# EAGLE schematic kulgurpowerMCU2 (EAGLE 6.3)

## Sheet 1 of 6
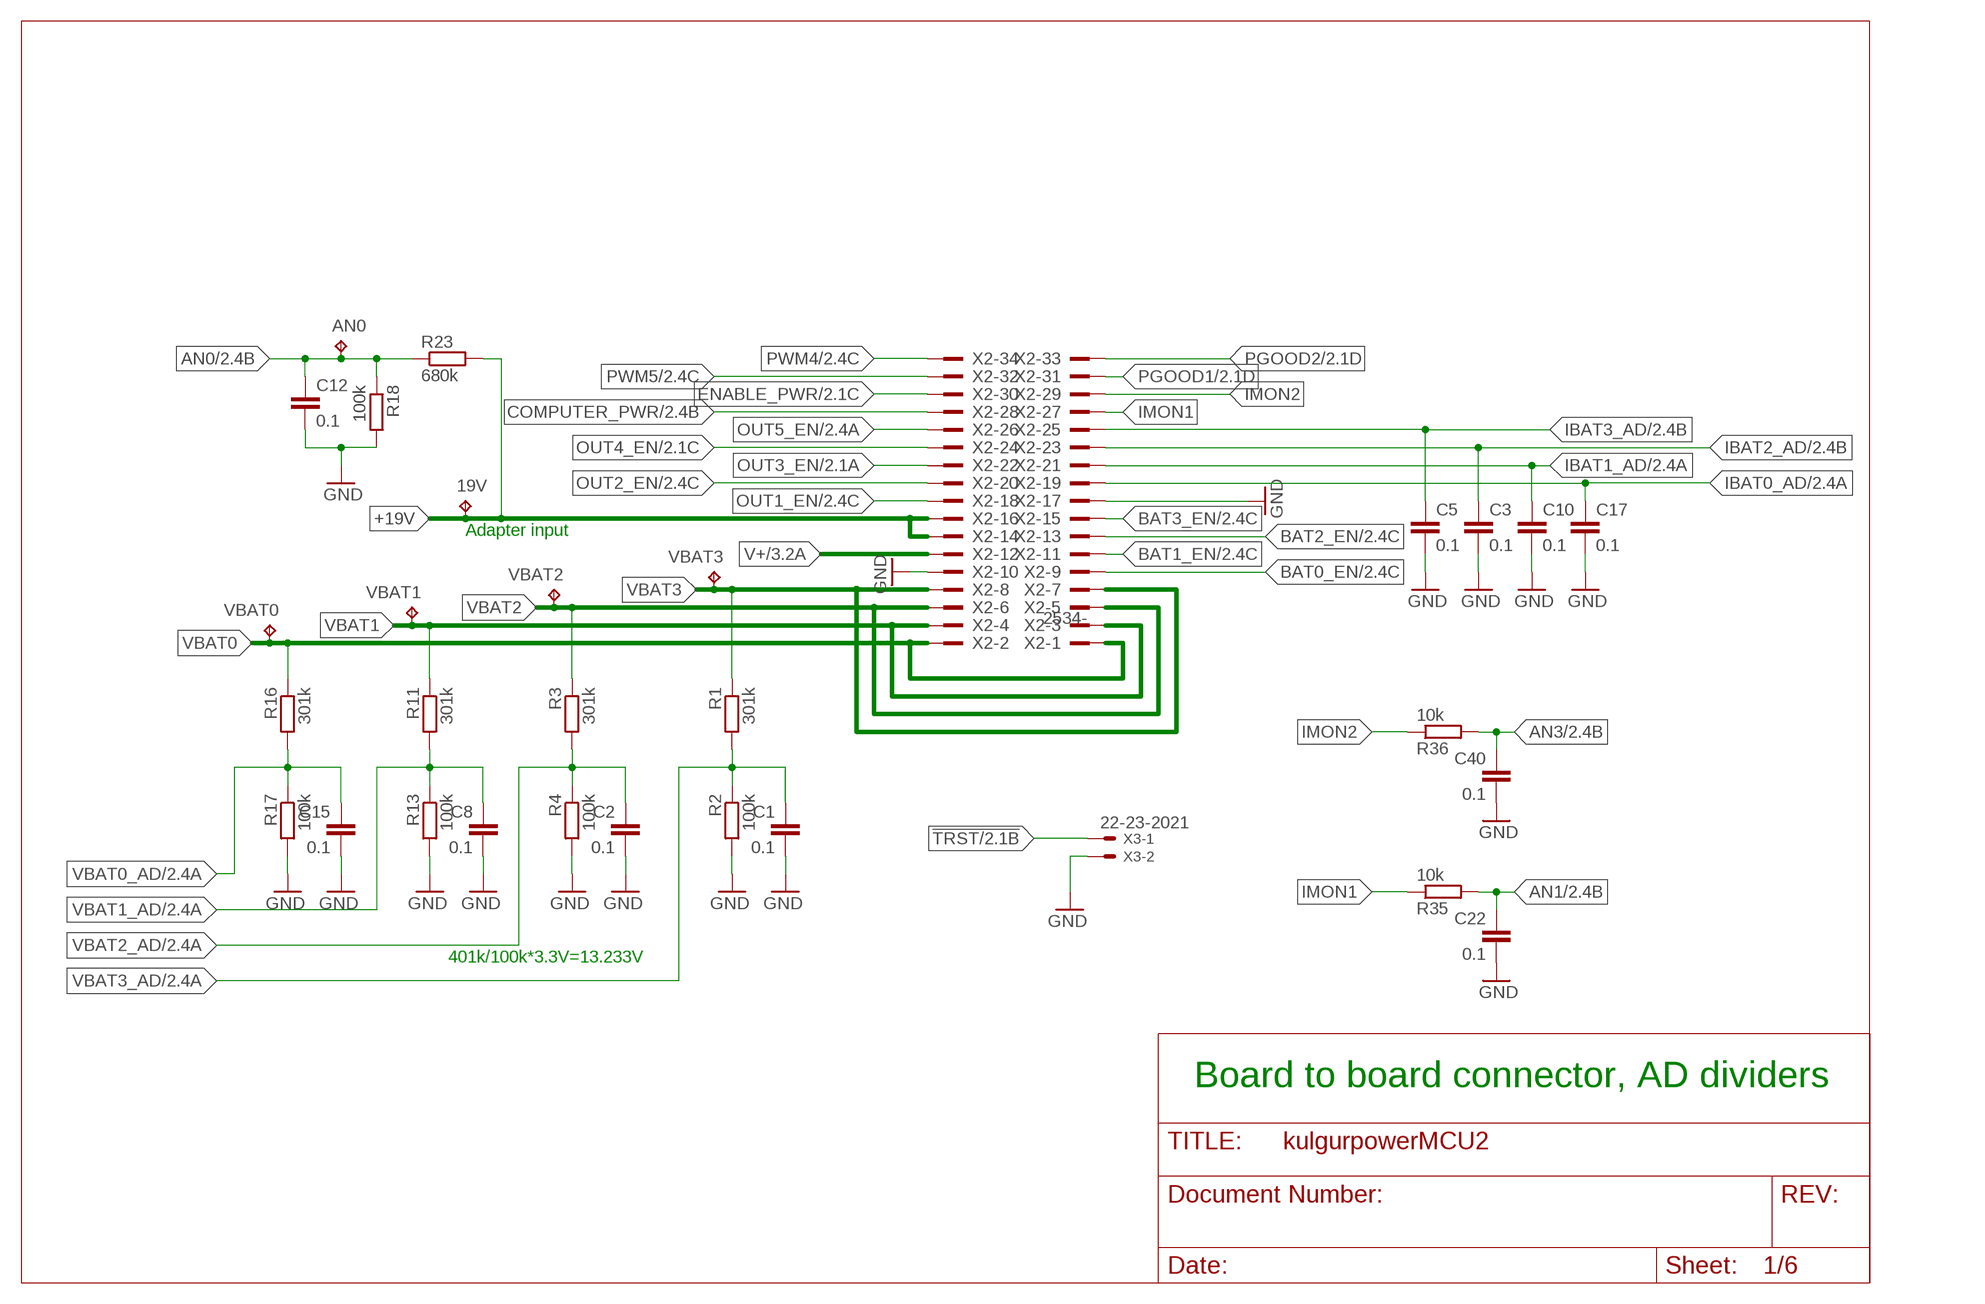
[diagram p0: schematic, sheet 1]

### Parts
19V  TPB1,27  [B1,27]
AN0  TPB1,27  [B1,27]
C1  0.1  C-EUC0603  [C0603]
C2  0.1  C-EUC0603  [C0603]
C3  0.1  C-EUC0603  [C0603]
C5  0.1  C-EUC0603  [C0603]
C8  0.1  C-EUC0603  [C0603]
C10  0.1  C-EUC0603  [C0603]
C12  0.1  CAP0603-CAP  [0603-CAP]
C15  0.1  C-EUC0603  [C0603]
C17  0.1  C-EUC0603  [C0603]
C22  0.1  C-EUC0603  [C0603]
C40  0.1  C-EUC0603  [C0603]
R1  301k  R-EU_R0603  [R0603]
R2  100k  R-EU_R0603  [R0603]
R3  301k  R-EU_R0603  [R0603]
R4  100k  R-EU_R0603  [R0603]
R11  301k  R-EU_R0603  [R0603]
R13  100k  R-EU_R0603  [R0603]
R16  301k  R-EU_R0603  [R0603]
R17  100k  R-EU_R0603  [R0603]
R18  100k  R-EU_R0603  [R0603]
R23  680k  R-EU_R0603  [R0603]
R35  10k  R-EU_R0603  [R0603]
R36  10k  R-EU_R0603  [R0603]
VBAT0  TPB1,27  [B1,27]
VBAT1  TPB1,27  [B1,27]
VBAT2  TPB1,27  [B1,27]
VBAT3  TPB1,27  [B1,27]
X2  2534-  [PAK100/2500-34]
X3  22-23-2021  [22-23-2021]

### Nets
!TRST: X3.1 ; also sheet 2,4
+19V [morepower]: 19V.TP R23.2 X2.14 X2.16 ; also sheet 6
AN0: AN0.TP C12.1 R18.1 R23.1 ; also sheet 2
AN1: C22.1 R35.2 ; also sheet 2
AN3: C40.1 R36.2 ; also sheet 2
BAT0_EN: X2.9 ; also sheet 2
BAT1_EN: X2.11 ; also sheet 2
BAT2_EN: X2.13 ; also sheet 2
BAT3_EN: X2.15 ; also sheet 2
COMPUTER_PWR: X2.28 ; also sheet 2
ENABLE_PWR: X2.30 ; also sheet 2
GND: C1.2 C2.2 C3.2 C5.2 C8.2 C10.2 C12.2 C15.2 C17.2 C22.2 C40.2 R2.2 R4.2 R13.2 R17.2 R18.2 X2.10 X2.17 X3.2 ; also sheet 2,3,4,5,6
IBAT0_AD: C17.1 X2.19 ; also sheet 2
IBAT1_AD: C10.1 X2.21 ; also sheet 2
IBAT2_AD: C3.1 X2.23 ; also sheet 2
IBAT3_AD: C5.1 X2.25 ; also sheet 2
IMON1: R35.1 X2.27
IMON2: R36.1 X2.29
OUT1_EN: X2.18 ; also sheet 2
OUT2_EN: X2.20 ; also sheet 2
OUT3_EN: X2.22 ; also sheet 2
OUT4_EN: X2.24 ; also sheet 2
OUT5_EN: X2.26 ; also sheet 2
PGOOD1: X2.31 ; also sheet 2
PGOOD2: X2.33 ; also sheet 2
PWM4: X2.34 ; also sheet 2
PWM5: X2.32 ; also sheet 2
V+: X2.12 ; also sheet 3
VBAT0 [morepower]: R16.1 VBAT0.TP X2.1 X2.2 ; also sheet 6
VBAT0_AD: C15.1 R16.2 R17.1 ; also sheet 2
VBAT1 [morepower]: R11.1 VBAT1.TP X2.3 X2.4 ; also sheet 6
VBAT1_AD: C8.1 R11.2 R13.1 ; also sheet 2
VBAT2 [morepower]: R3.1 VBAT2.TP X2.5 X2.6 ; also sheet 6
VBAT2_AD: C2.1 R3.2 R4.1 ; also sheet 2
VBAT3 [morepower]: R1.1 VBAT3.TP X2.7 X2.8 ; also sheet 6
VBAT3_AD: C1.1 R1.2 R2.1 ; also sheet 2

### Notes on the sheet
- Adapter input
- 401k/100k*3.3V=13.233V
- Board to board connector, AD dividers

## Sheet 2 of 6
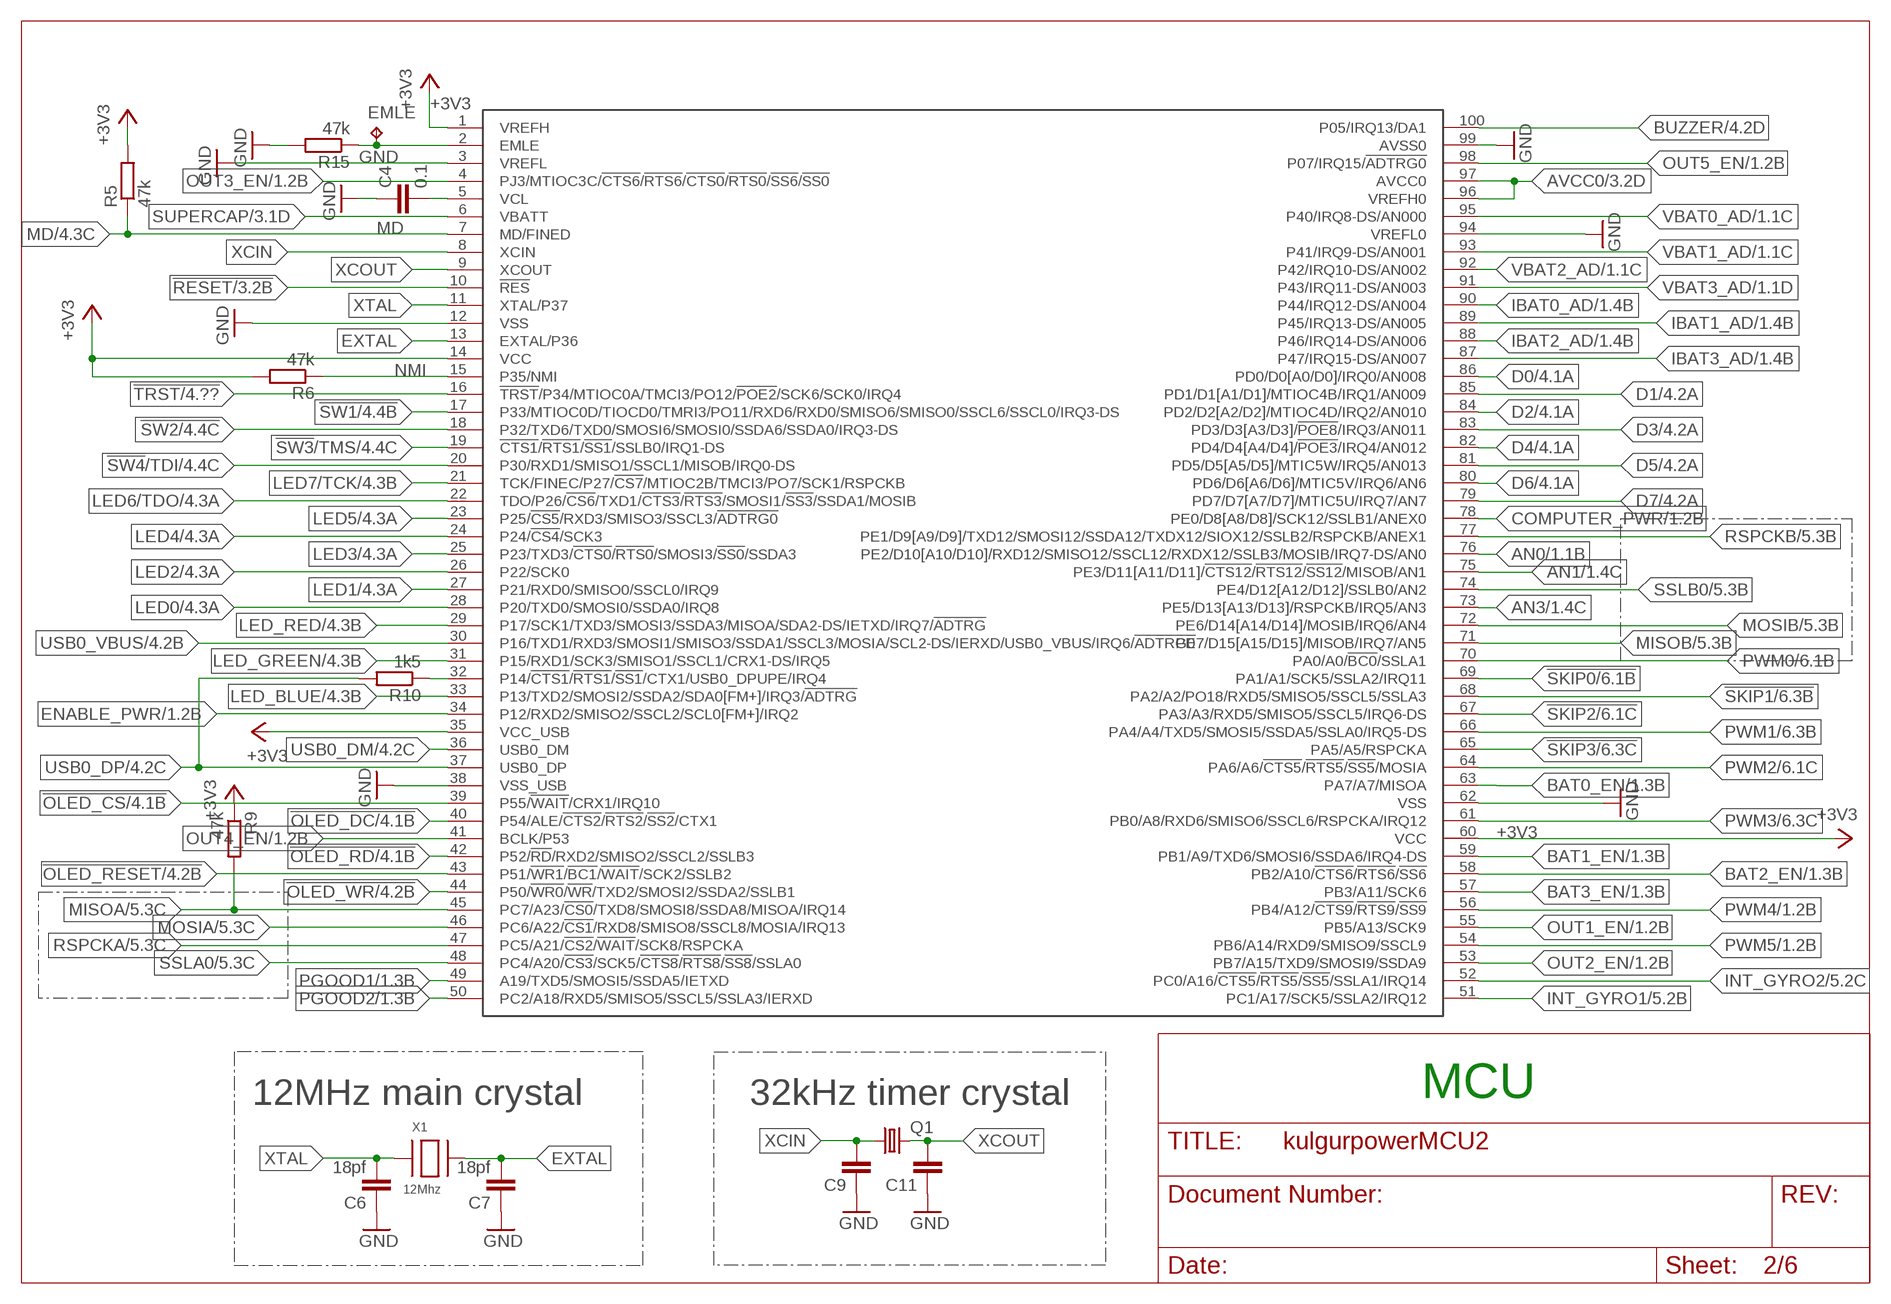
[diagram p1: schematic, sheet 2]

### Parts
C4  0.1  CAP0603-CAP  [0603-CAP]
C6  18pf  CAP0603-CAP  [0603-CAP]
C7  18pf  CAP0603-CAP  [0603-CAP]
C9  CAP0603-CAP  [0603-CAP]
C11  CAP0603-CAP  [0603-CAP]
EMLE  TPB1,27  [B1,27]
Q1  CRYSTALMM20SS  [MM20SS]
R5  47k  R-EU_R0603  [R0603]
R6  47k  R-EU_R0603  [R0603]
R9  47k  R-EU_R0603  [R0603]
R10  1k5  R-EU_R0603  [R0603]
R15  47k  R-EU_R0603  [R0603]
U$14  R5F5630ADDFP  [LTQFP100]
X1  12Mhz  XTALNX5032  [NX5032]

### Nets
!OLED_CS: U$14.39(P55/!WAIT!/CRX1/IRQ10) ; also sheet 4
!OLED_DC: U$14.40(P54/ALE/!CTS2!/!RTS2!/!SS2!/CTX1) ; also sheet 4
!OLED_RD: U$14.42(P52/!RD!/RXD2/SMISO2/SSCL2/SSLB3) ; also sheet 4
!OLED_RESET: U$14.43(P51/!WR1!/!BC1!/!WAIT!/SCK2/SSLB2) ; also sheet 4
!OLED_WR: U$14.44(P50/!WR0!/!WR!/TXD2/SMOSI2/SSDA2/SSLB1) ; also sheet 4
!RESET: U$14.10(!RES!) ; also sheet 3,4
!SKIP0 [thin]: U$14.69(PA1/A1/SCK5/SSLA2/IRQ11) ; also sheet 6
!SKIP1 [thin]: U$14.68(PA2/A2/PO18/RXD5/SMISO5/SSCL5/SSLA3) ; also sheet 6
!SKIP2 [thin]: U$14.67(PA3/A3/RXD5/SMISO5/SSCL5/IRQ6-DS) ; also sheet 6
!SKIP3 [thin]: U$14.65(PA5/A5/RSPCKA) ; also sheet 6
!SW1: U$14.17(P33/MTIOC0D/TIOCD0/TMRI3/PO11/RXD6/RXD0/SMISO6/SMISO0/SSCL6/SSCL0/IRQ3-DS) ; also sheet 4
!SW2: U$14.18(P32/TXD6/TXD0/SMOSI6/SMOSI0/SSDA6/SSDA0/IRQ3-DS) ; also sheet 4
!SW3!/TMS: U$14.19(!CTS1!/!RTS1!/!SS1!/SSLB0/IRQ1-DS) ; also sheet 4
!SW4!/TDI: U$14.20(P30/RXD1/SMISO1/SSCL1/MISOB/IRQ0-DS) ; also sheet 4
!TRST: U$14.16(!TRST!/P34/MTIOC0A/TMCI3/PO12/!POE2!/SCK6/SCK0/IRQ4) ; also sheet 1,4
+3V3: R5.2 R6.2 R9.1 U$14.1(VREFH) U$14.14(VCC) U$14.35(VCC_USB) U$14.60(VCC) ; also sheet 3,4,5
AN0: U$14.76(PE2/D10[A10/D10]/RXD12/SMISO12/SSCL12/RXDX12/SSLB3/MOSIB/IRQ7-DS/AN0) ; also sheet 1
AN1: U$14.75(PE3/D11[A11/D11]/!CTS12!/!RTS12!/!SS12!/MISOB/AN1) ; also sheet 1
AN3: U$14.73(PE5/D13[A13/D13]/RSPCKB/IRQ5/AN3) ; also sheet 1
AVCC0: U$14.96(VREFH0) U$14.97(AVCC0) ; also sheet 3
BAT0_EN: U$14.63(PA7/A7/MISOA) ; also sheet 1
BAT1_EN: U$14.59(PB1/A9/TXD6/SMOSI6/SSDA6/IRQ4-DS) ; also sheet 1
BAT2_EN: U$14.58(PB2/A10/!CTS6!/!RTS6!/!SS6!) ; also sheet 1
BAT3_EN: U$14.57(PB3/A11/SCK6) ; also sheet 1
BUZZER: U$14.100(P05/IRQ13/DA1) ; also sheet 4
COMPUTER_PWR: U$14.78(PE0/D8[A8/D8]/SCK12/SSLB1/ANEX0) ; also sheet 1
D0: U$14.86(PD0/D0[A0/D0]/IRQ0/AN008) ; also sheet 4
D1: U$14.85(PD1/D1[A1/D1]/MTIOC4B/IRQ1/AN009) ; also sheet 4
D2: U$14.84(PD2/D2[A2/D2]/MTIOC4D/IRQ2/AN010) ; also sheet 4
D3: U$14.83(PD3/D3[A3/D3]/!POE8!/IRQ3/AN011) ; also sheet 4
D4: U$14.82(PD4/D4[A4/D4]/!POE3!/IRQ4/AN012) ; also sheet 4
D5: U$14.81(PD5/D5[A5/D5]/MTIC5W/IRQ5/AN013) ; also sheet 4
D6: U$14.80(PD6/D6[A6/D6]/MTIC5V/IRQ6/AN6) ; also sheet 4
D7: U$14.79(PD7/D7[A7/D7]/MTIC5U/IRQ7/AN7) ; also sheet 4
EMLE: EMLE.TP R15.1 U$14.2(EMLE) ; also sheet 4
ENABLE_PWR: U$14.34(P12/RXD2/SMISO2/SSCL2/SCL0[FM+]/IRQ2) ; also sheet 1
EXTAL: C7.2 U$14.13(EXTAL/P36) X1.P$2
GND: C4.1 C6.1 C7.1 C9.1 C11.1 R15.2 U$14.3(VREFL) U$14.12(VSS) U$14.38(VSS_USB) U$14.62(VSS) U$14.94(VREFL0) U$14.99(AVSS0) ; also sheet 1,3,4,5,6
IBAT0_AD: U$14.90(P44/IRQ12-DS/AN004) ; also sheet 1
IBAT1_AD: U$14.89(P45/IRQ13-DS/AN005) ; also sheet 1
IBAT2_AD: U$14.88(P46/IRQ14-DS/AN006) ; also sheet 1
IBAT3_AD: U$14.87(P47/IRQ15-DS/AN007) ; also sheet 1
INT_GYRO1: U$14.51(PC1/A17/SCK5/SSLA2/IRQ12) ; also sheet 5
INT_GYRO2: U$14.52(PC0/A16/!CTS5!/!RTS5!/!SS5!/SSLA1/IRQ14) ; also sheet 5
LED0: U$14.28(P20/TXD0/SMOSI0/SSDA0/IRQ8) ; also sheet 4
LED1: U$14.27(P21/RXD0/SMISO0/SSCL0/IRQ9) ; also sheet 4
LED2: U$14.26(P22/SCK0) ; also sheet 4
LED3: U$14.25(P23/TXD3/!CTS0!/!RTS0!/SMOSI3/!SS0!/SSDA3) ; also sheet 4
LED4: U$14.24(P24/!CS4!/SCK3) ; also sheet 4
LED5: U$14.23(P25/!CS5!/RXD3/SMISO3/SSCL3/!ADTRG0!) ; also sheet 4
LED6/TDO: U$14.22(TDO/P26/!CS6!/TXD1/!CTS3!/!RTS3!/SMOSI1/!SS3!/SSDA1/MOSIB) ; also sheet 4
LED7/TCK: U$14.21(TCK/FINEC/P27/!CS7!/MTIOC2B/TMCI3/PO7/SCK1/RSPCKB) ; also sheet 4
LED_BLUE: U$14.33(P13/TXD2/SMOSI2/SSDA2/SDA0[FM+]/IRQ3/!ADTRG!) ; also sheet 4
LED_GREEN: U$14.31(P15/RXD1/SCK3/SMISO1/SSCL1/CRX1-DS/IRQ5) ; also sheet 4
LED_RED: U$14.29(P17/SCK1/TXD3/SMOSI3/SSDA3/MISOA/SDA2-DS/IETXD/IRQ7/!ADTRG!) ; also sheet 4
MD: R5.1 U$14.7(MD/FINED) ; also sheet 4
MISOA: R9.2 U$14.45(PC7/A23/!CS0!/TXD8/SMOSI8/SSDA8/MISOA/IRQ14) ; also sheet 5
MISOB: U$14.71(PE7/D15[A15/D15]/MISOB/IRQ7/AN5) ; also sheet 5
MOSIA: U$14.46(PC6/A22/!CS1!/RXD8/SMISO8/SSCL8/MOSIA/IRQ13) ; also sheet 5
MOSIB: U$14.72(PE6/D14[A14/D14]/MOSIB/IRQ6/AN4) ; also sheet 5
N$3: C4.2 U$14.5(VCL)
NMI: R6.1 U$14.15(P35/NMI)
OUT1_EN: U$14.55(PB5/A13/SCK9) ; also sheet 1
OUT2_EN: U$14.53(PB7/A15/TXD9/SMOSI9/SSDA9) ; also sheet 1
OUT3_EN: U$14.4(PJ3/MTIOC3C/!CTS6!/!RTS6!/!CTS0!/!RTS0!/!SS6!/!SS0!) ; also sheet 1
OUT4_EN: U$14.41(BCLK/P53) ; also sheet 1
OUT5_EN: U$14.98(P07/IRQ15/!ADTRG0) ; also sheet 1
PGOOD1: U$14.49(A19/TXD5/SMOSI5/SSDA5/IETXD) ; also sheet 1
PGOOD2: U$14.50(PC2/A18/RXD5/SMISO5/SSCL5/SSLA3/IERXD) ; also sheet 1
PWM0 [thin]: U$14.70(PA0/A0/!BC0!/SSLA1) ; also sheet 6
PWM1 [thin]: U$14.66(PA4/A4/TXD5/SMOSI5/SSDA5/SSLA0/IRQ5-DS) ; also sheet 6
PWM2 [thin]: U$14.64(PA6/A6/!CTS5!/!RTS5!/!SS5!/MOSIA) ; also sheet 6
PWM3 [thin]: U$14.61(PB0/A8/RXD6/SMISO6/SSCL6/RSPCKA/IRQ12) ; also sheet 6
PWM4: U$14.56(PB4/A12/!CTS9!/!RTS9!/!SS9!) ; also sheet 1
PWM5: U$14.54(PB6/A14/RXD9/SMISO9/SSCL9) ; also sheet 1
RSPCKA: U$14.47(PC5/A21/!CS2!/!WAIT!/SCK8/RSPCKA) ; also sheet 5
RSPCKB: U$14.77(PE1/D9[A9/D9]/TXD12/SMOSI12/SSDA12/TXDX12/SIOX12/SSLB2/RSPCKB/ANEX1) ; also sheet 5
SSLA0: U$14.48(PC4/A20/!CS3!/SCK5/!CTS8!/!RTS8!/!SS8!/SSLA0) ; also sheet 5
SSLB0: U$14.74(PE4/D12[A12/D12]/SSLB0/AN2) ; also sheet 5
SUPERCAP: U$14.6(VBATT) ; also sheet 3
USB0_DM: U$14.36(USB0_DM) ; also sheet 4
USB0_DP: R10.2 U$14.37(USB0_DP) ; also sheet 4
USB0_DPUPE: R10.1 U$14.32(P14/!CTS1!/!RTS1!/!SS1!/CTX1/USB0_DPUPE/IRQ4)
USB0_VBUS: U$14.30(P16/TXD1/RXD3/SMOSI1/SMISO3/SSDA1/SSCL3/MOSIA/SCL2-DS/IERXD/USB0_VBUS/IRQ6/!ADTRG0!) ; also sheet 4
VBAT0_AD: U$14.95(P40/IRQ8-DS/AN000) ; also sheet 1
VBAT1_AD: U$14.93(P41/IRQ9-DS/AN001) ; also sheet 1
VBAT2_AD: U$14.92(P42/IRQ10-DS/AN002) ; also sheet 1
VBAT3_AD: U$14.91(P43/IRQ11-DS/AN003) ; also sheet 1
XCIN: C9.2 Q1.1 U$14.8(XCIN)
XCOUT: C11.2 Q1.4 U$14.9(XCOUT)
XTAL: C6.2 U$14.11(XTAL/P37) X1.P$1

### Notes on the sheet
- 12MHz main crystal | 32kHz timer crystal | MCU

## Sheet 3 of 6
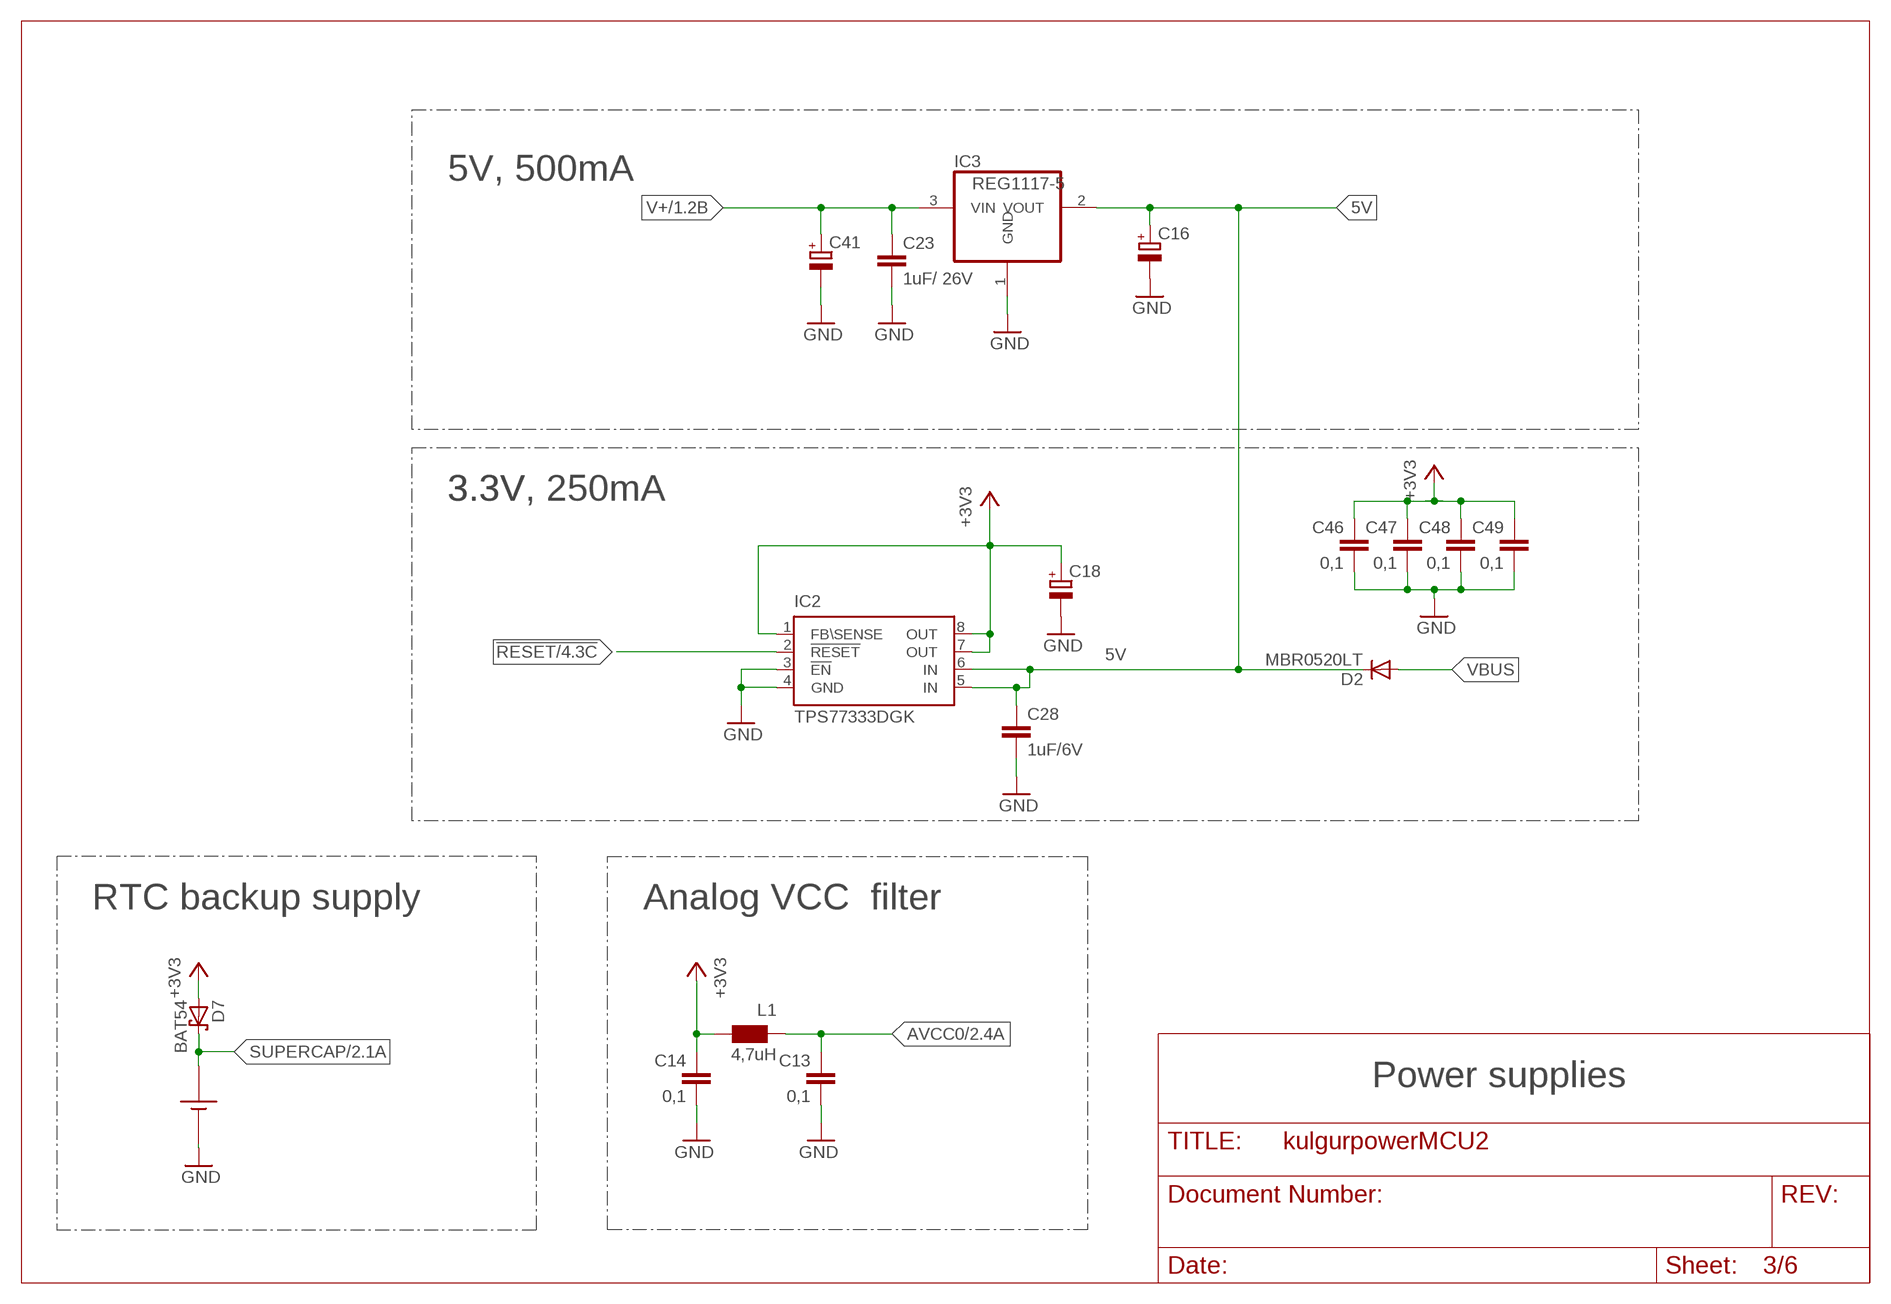
[diagram p2: schematic, sheet 3]

### Parts
C13  0,1  CAP0603-CAP  [0603-CAP]
C14  0,1  CAP0603-CAP  [0603-CAP]
C16  CPOL-EUC/6032-28R  [C/6032-28R]
C18  CPOL-EUC/6032-28R  [C/6032-28R]
C23  1uF/ 26V  C-EUC0805  [C0805]
C28  1uF/6V  C-EUC0603  [C0603]
C41  CPOL-EUC/6032-28R  [C/6032-28R]
C46  0,1  CAP0603-CAP  [0603-CAP]
C47  0,1  CAP0603-CAP  [0603-CAP]
C48  0,1  CAP0603-CAP  [0603-CAP]
C49  0,1  CAP0603-CAP  [0603-CAP]
D2  MBR0520LT  [SOD123]
D7  BAT54  [SOT23]
IC2  TPS77333DGK  TPS773  [MSOP8]
IC3  REG1117-5  REG1117  [SOT223]
L1  4,7uH  WE-KIHQ_0805  [WE-KI_0805_B]
U$1  EDLRD224V3R6C  [EDLRD224V3R6C]

### Nets
5V [thin]: C16.+ C28.1 D2.C IC2.5(IN) IC2.6(IN) IC3.2(VOUT) ; also sheet 6
!RESET: IC2.2(!RESET) ; also sheet 2,4
+3V3: C14.1 C18.+ C46.1 C47.1 C48.1 C49.1 D7.1(A) IC2.1(FB\SENSE) IC2.7(OUT) IC2.8(OUT) L1.1 ; also sheet 2,4,5
AVCC0: C13.1 L1.2 ; also sheet 2
GND: C13.2 C14.2 C16.- C18.- C23.2 C28.2 C41.- C46.2 C47.2 C48.2 C49.2 IC2.3(!EN) IC2.4(GND) IC3.1(GND) U$1.N ; also sheet 1,2,4,5,6
SUPERCAP: D7.3(C) U$1.P ; also sheet 2
V+: C23.1 C41.+ IC3.3(VIN) ; also sheet 1
VBUS: D2.A ; also sheet 4

### Notes on the sheet
- 5V, 500mA
- 3.3V | 3.3V, 250mA
- RTC backup supply | Analog VCC  filter
- Power supplies

## Sheet 4 of 6
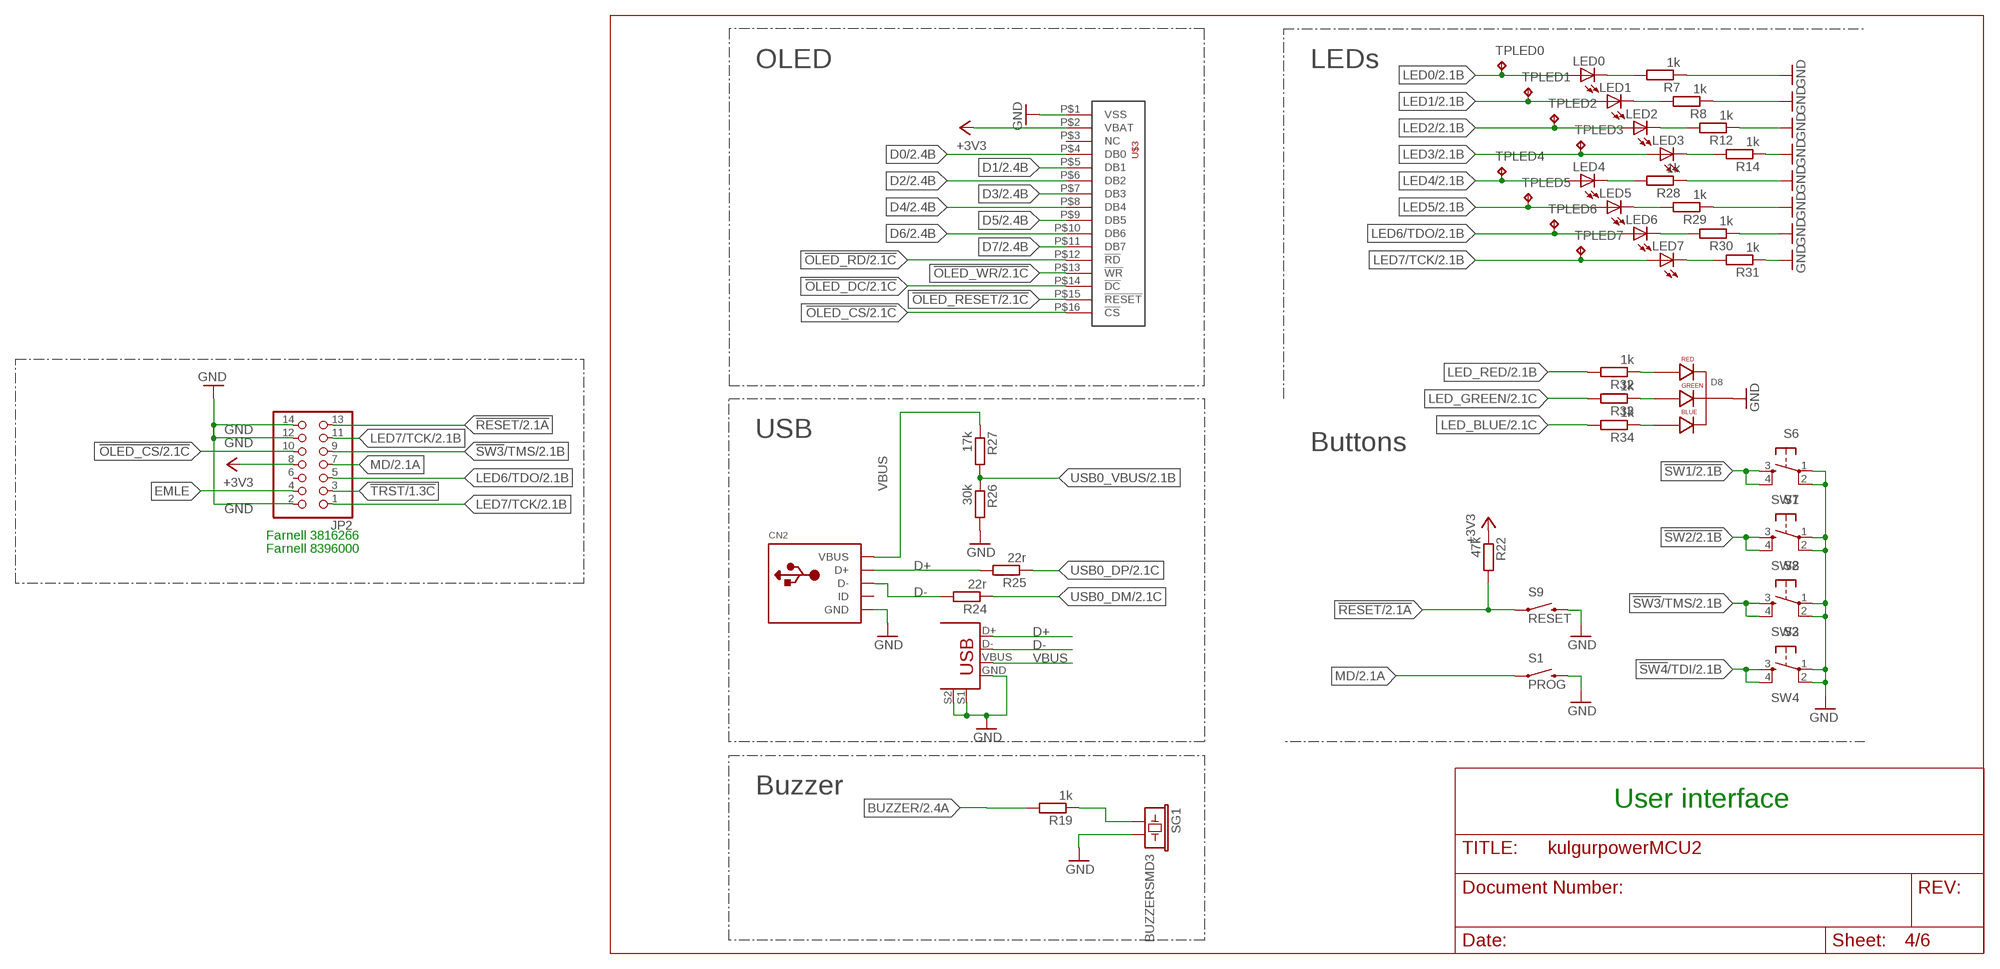
[diagram p3: schematic, sheet 4]

### Parts
CN2  USBMINIB  [USB-MINIB]
D8  WP154A4SUREQBFZGW  LED-RGB-CC-THRUDIFFUSE  [LED-RGB-THRU]
JP2  PINHD-2X7  [2X07]
LED0  LED0603  [LED-0603]
LED1  LED0603  [LED-0603]
LED2  LED0603  [LED-0603]
LED3  LED0603  [LED-0603]
LED4  LED0603  [LED-0603]
LED5  LED0603  [LED-0603]
LED6  LED0603  [LED-0603]
LED7  LED0603  [LED-0603]
R7  1k  R-EU_R0603  [R0603]
R8  1k  R-EU_R0603  [R0603]
R12  1k  R-EU_R0603  [R0603]
R14  1k  R-EU_R0603  [R0603]
R19  1k  R-EU_R0603  [R0603]
R22  47k  R-EU_R0603  [R0603]
R24  22r  R-EU_R0603  [R0603]
R25  22r  R-EU_R0603  [R0603]
R26  30k  R-EU_R0603  [R0603]
R27  17k  R-EU_R0603  [R0603]
R28  1k  R-EU_R0603  [R0603]
R29  1k  R-EU_R0603  [R0603]
R30  1k  R-EU_R0603  [R0603]
R31  1k  R-EU_R0603  [R0603]
R32  1k  R-EU_R0603  [R0603]
R33  1k  R-EU_R0603  [R0603]
R34  1k  R-EU_R0603  [R0603]
S1  PROG  SWITCH-MOMENTARY-2SIDE_EZ  [TACTILE-PTH-SIDEEZ]
S2  SW4  TAC_SWITCHSMD  [TACTILE_SWITCH_SMD]
S6  SW1  TAC_SWITCHSMD  [TACTILE_SWITCH_SMD]
S7  SW2  TAC_SWITCHSMD  [TACTILE_SWITCH_SMD]
S8  SW3  TAC_SWITCHSMD  [TACTILE_SWITCH_SMD]
S9  RESET  SWITCH-MOMENTARY-2SIDE_EZ  [TACTILE-PTH-SIDEEZ]
SG1  BUZZERSMD3  [BUZZER-CMT1102]
TPLED0  LED0  TPB1,27  [B1,27]
TPLED1  LED0  TPB1,27  [B1,27]
TPLED2  LED0  TPB1,27  [B1,27]
TPLED3  LED0  TPB1,27  [B1,27]
TPLED4  LED0  TPB1,27  [B1,27]
TPLED5  LED0  TPB1,27  [B1,27]
TPLED6  LED0  TPB1,27  [B1,27]
TPLED7  LED0  TPB1,27  [B1,27]
U$2  USB+SHIELD  [USB-B-PTH]
U$3  ER-OLEDM032-1  [ER-OLEDM032-1]

### Nets
!OLED_CS: JP2.10 U$3.P$16(!CS) ; also sheet 2
!OLED_DC: U$3.P$14(!DC) ; also sheet 2
!OLED_RD: U$3.P$12(!RD) ; also sheet 2
!OLED_RESET: U$3.P$15(!RESET) ; also sheet 2
!OLED_WR: U$3.P$13(!WR) ; also sheet 2
!RESET: JP2.13 R22.2 S9.1 ; also sheet 2,3
!SW1: S6.3 S6.4 ; also sheet 2
!SW2: S7.3 S7.4 ; also sheet 2
!SW3!/TMS: JP2.9 S8.3 S8.4 ; also sheet 2
!SW4!/TDI: S2.3 S2.4 ; also sheet 2
!TRST: JP2.3 ; also sheet 1,2
+3V3: JP2.8 R22.1 U$3.P$2(VBAT) ; also sheet 2,3,5
BUZZER: R19.2 ; also sheet 2
BUZZER_X: R19.1 SG1.1
D0: U$3.P$4(DB0) ; also sheet 2
D1: U$3.P$5(DB1) ; also sheet 2
D2: U$3.P$6(DB2) ; also sheet 2
D3: U$3.P$7(DB3) ; also sheet 2
D4: U$3.P$8(DB4) ; also sheet 2
D5: U$3.P$9(DB5) ; also sheet 2
D6: U$3.P$10(DB6) ; also sheet 2
D7: U$3.P$11(DB7) ; also sheet 2
D+: CN2.D+ R25.2 U$2.D+
D-: CN2.D- R24.2 U$2.D-
EMLE: JP2.4 ; also sheet 2
GND: CN2.GND D8.2(CATHODE) JP2.2 JP2.12 JP2.14 R7.1 R8.1 R12.1 R14.1 R26.2 R28.1 R29.1 R30.1 R31.1 S1.2 S2.1 S2.2 S6.1 S6.2 S7.1 S7.2 S8.1 S8.2 S9.2 SG1.2 U$2.GND U$2.S1 U$2.S2 U$3.P$1(VSS) ; also sheet 1,2,3,5,6
LED0: LED0.A TPLED0.TP ; also sheet 2
LED1: LED1.A TPLED1.TP ; also sheet 2
LED2: LED2.A TPLED2.TP ; also sheet 2
LED3: LED3.A TPLED3.TP ; also sheet 2
LED4: LED4.A TPLED4.TP ; also sheet 2
LED5: LED5.A TPLED5.TP ; also sheet 2
LED6/TDO: JP2.5 LED6.A TPLED6.TP ; also sheet 2
LED7/TCK: JP2.1 JP2.11 LED7.A TPLED7.TP ; also sheet 2
LED_BLUE: R34.2 ; also sheet 2
LED_GREEN: R33.2 ; also sheet 2
LED_RED: R32.2 ; also sheet 2
MD: JP2.7 S1.1 ; also sheet 2
N$2: LED0.C R7.2
N$4: D8.1(RED_CATHODE) R32.1
N$8: LED1.C R8.2
N$9: LED2.C R12.2
N$10: LED3.C R14.2
N$11: LED4.C R28.2
N$12: LED5.C R29.2
N$13: LED6.C R30.2
N$14: LED7.C R31.2
N$15: D8.3(GREEN_CATHODE) R33.1
N$17: D8.4(BLUE_CATHODE) R34.1
USB0_DM: R24.1 ; also sheet 2
USB0_DP: R25.1 ; also sheet 2
USB0_VBUS: R26.1 R27.2 ; also sheet 2
VBUS: CN2.VBUS R27.1 U$2.VBUS ; also sheet 3
Unconnected: CN2.ID JP2.6 U$3.P$3(NC)

### Notes on the sheet
- OLED | LEDs
- USB
- Buttons
- Farnell 3816266
- Farnell 8396000
- Buzzer
- User interface

## Sheet 5 of 6
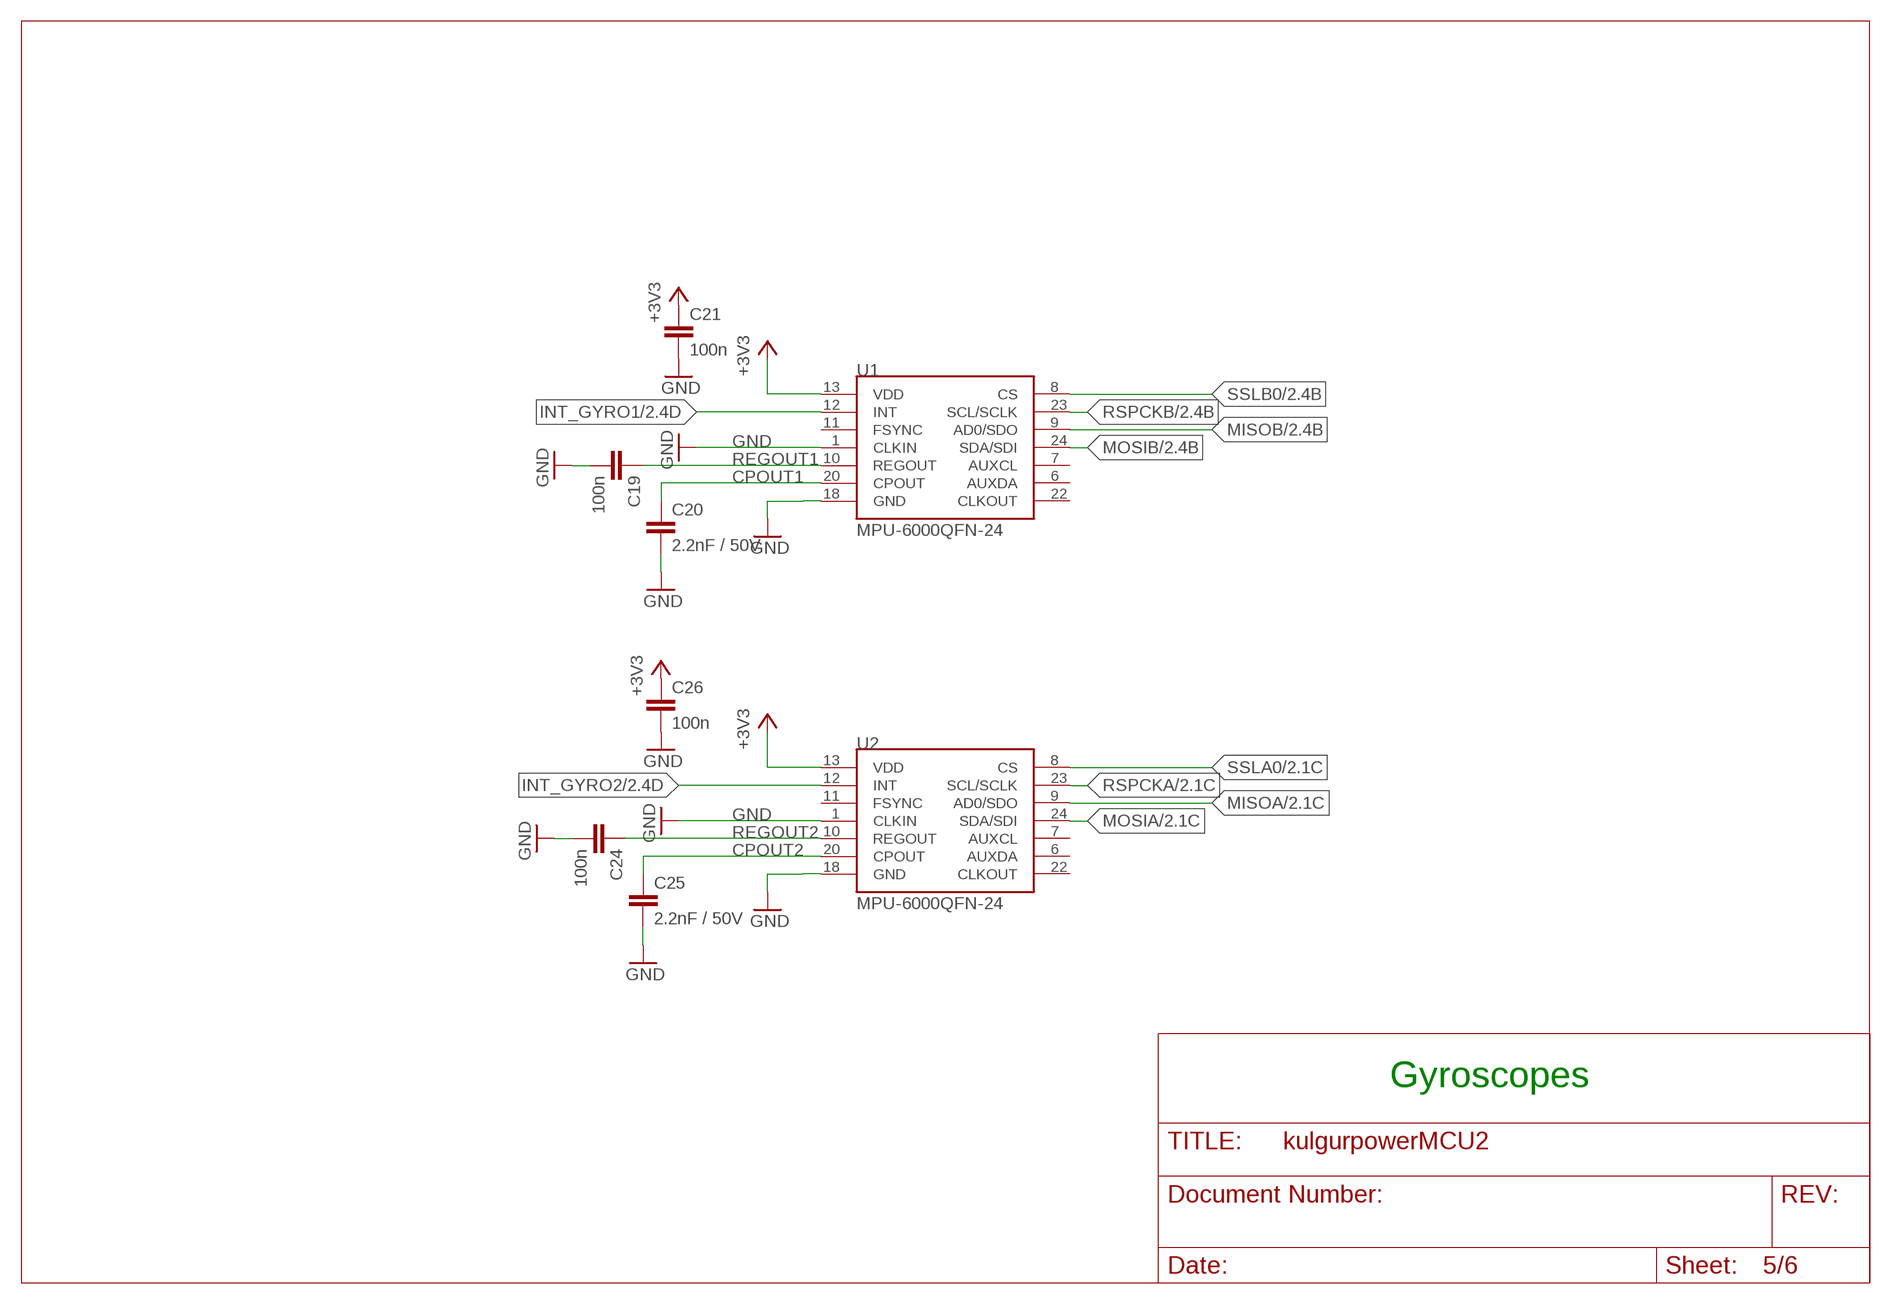
[diagram p4: schematic, sheet 5]

### Parts
C19  100n  C-EUC0603  [C0603]
C20  2.2nF / 50V  C0402  [C0402]
C21  100n  C-EUC0603  [C0603]
C24  100n  C-EUC0603  [C0603]
C25  2.2nF / 50V  C0402  [C0402]
C26  100n  C-EUC0603  [C0603]
U1  MPU-6000QFN-24  [QFN-24-TESTING]
U2  MPU-6000QFN-24  [QFN-24-TESTING]

### Nets
+3V3: C21.1 C26.1 U1.13(VDD) U2.13(VDD) ; also sheet 2,3,4
CPOUT1: C20.1 U1.20(CPOUT)
CPOUT2: C25.1 U2.20(CPOUT)
GND: C19.2 C20.2 C21.2 C24.2 C25.2 C26.2 U1.1(CLKIN) U1.18(GND) U2.1(CLKIN) U2.18(GND) ; also sheet 1,2,3,4,6
INT_GYRO1: U1.12(INT) ; also sheet 2
INT_GYRO2: U2.12(INT) ; also sheet 2
MISOA: U2.9(AD0/SDO) ; also sheet 2
MISOB: U1.9(AD0/SDO) ; also sheet 2
MOSIA: U2.24(SDA/SDI) ; also sheet 2
MOSIB: U1.24(SDA/SDI) ; also sheet 2
REGOUT1: C19.1 U1.10(REGOUT)
REGOUT2: C24.1 U2.10(REGOUT)
RSPCKA: U2.23(SCL/SCLK) ; also sheet 2
RSPCKB: U1.23(SCL/SCLK) ; also sheet 2
SSLA0: U2.8(CS) ; also sheet 2
SSLB0: U1.8(CS) ; also sheet 2
Unconnected: U1.6(AUXDA) U1.7(AUXCL) U1.11(FSYNC) U1.22(CLKOUT) U2.6(AUXDA) U2.7(AUXCL) U2.11(FSYNC) U2.22(CLKOUT)

### Notes on the sheet
- Gyroscopes

## Sheet 6 of 6
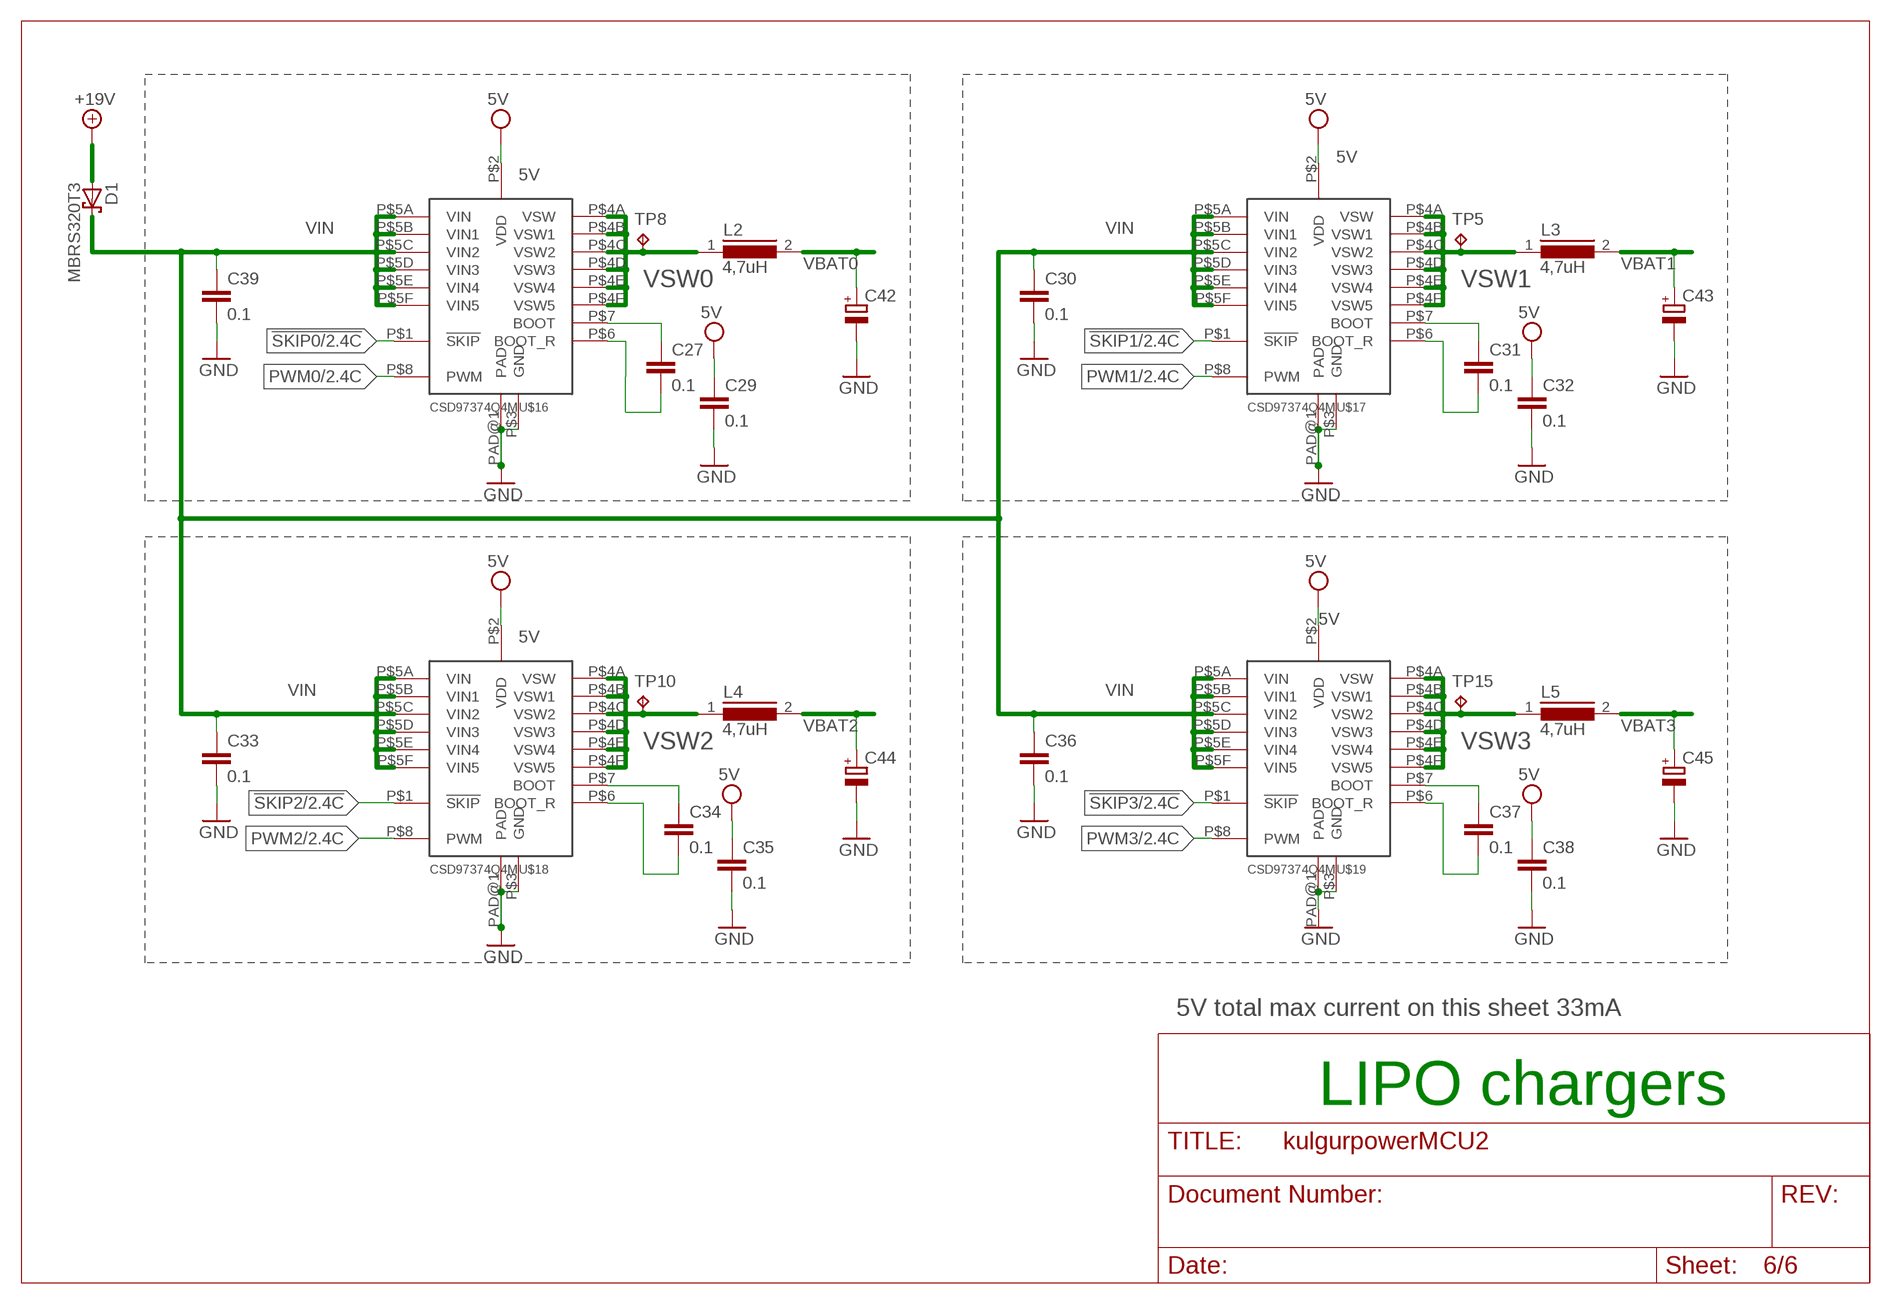
[diagram p5: schematic, sheet 6]

### Parts
C27  0.1  C-EUC0603  [C0603]
C29  0.1  C-EUC0603  [C0603]
C30  0.1  C-EUC0603  [C0603]
C31  0.1  C-EUC0603  [C0603]
C32  0.1  C-EUC0603  [C0603]
C33  0.1  C-EUC0603  [C0603]
C34  0.1  C-EUC0603  [C0603]
C35  0.1  C-EUC0603  [C0603]
C36  0.1  C-EUC0603  [C0603]
C37  0.1  C-EUC0603  [C0603]
C38  0.1  C-EUC0603  [C0603]
C39  0.1  C-EUC0603  [C0603]
C42  CPOL-EUC/6032-28R  [C/6032-28R]
C43  CPOL-EUC/6032-28R  [C/6032-28R]
C44  CPOL-EUC/6032-28R  [C/6032-28R]
C45  CPOL-EUC/6032-28R  [C/6032-28R]
D1  MBRS320T3  [SMC]
L2  4,7uH  DR73  [DR73]
L3  4,7uH  DR73  [DR73]
L4  4,7uH  DR73  [DR73]
L5  4,7uH  DR73  [DR73]
TP5  TPB2,54  [B2,54]
TP8  TPB2,54  [B2,54]
TP10  TPB2,54  [B2,54]
TP15  TPB2,54  [B2,54]
U$16  CSD97374Q4M  [CSD97374Q4M]
U$17  CSD97374Q4M  [CSD97374Q4M]
U$18  CSD97374Q4M  [CSD97374Q4M]
U$19  CSD97374Q4M  [CSD97374Q4M]

### Nets
5V [thin]: C29.1 C32.1 C35.1 C38.1 U$16.P$2(VDD) U$17.P$2(VDD) U$18.P$2(VDD) U$19.P$2(VDD) ; also sheet 3
!SKIP0 [thin]: U$16.P$1(!SKIP) ; also sheet 2
!SKIP1 [thin]: U$17.P$1(!SKIP) ; also sheet 2
!SKIP2 [thin]: U$18.P$1(!SKIP) ; also sheet 2
!SKIP3 [thin]: U$19.P$1(!SKIP) ; also sheet 2
+19V [morepower]: D1.A ; also sheet 1
GND: C29.2 C30.2 C32.2 C33.2 C35.2 C36.2 C38.2 C39.2 C42.- C43.- C44.- C45.- U$16.P$3(GND) U$16.PAD@1(PAD) U$17.P$3(GND) U$17.PAD@1(PAD) U$18.P$3(GND) U$18.PAD@1(PAD) U$19.P$3(GND) U$19.PAD@1(PAD) ; also sheet 1,2,3,4,5
N$18 [thin]: C37.1 U$19.P$7(BOOT)
N$19 [thin]: C31.1 U$17.P$7(BOOT)
N$20 [thin]: C37.2 U$19.P$6(BOOT_R)
N$21 [thin]: C31.2 U$17.P$6(BOOT_R)
N$22 [thin]: C27.1 U$16.P$7(BOOT)
N$23 [thin]: C27.2 U$16.P$6(BOOT_R)
N$24 [thin]: C34.1 U$18.P$7(BOOT)
N$25 [thin]: C34.2 U$18.P$6(BOOT_R)
PWM0 [thin]: U$16.P$8(PWM) ; also sheet 2
PWM1 [thin]: U$17.P$8(PWM) ; also sheet 2
PWM2 [thin]: U$18.P$8(PWM) ; also sheet 2
PWM3 [thin]: U$19.P$8(PWM) ; also sheet 2
VBAT0 [morepower]: C42.+ L2.2 ; also sheet 1
VBAT1 [morepower]: C43.+ L3.2 ; also sheet 1
VBAT2 [morepower]: C44.+ L4.2 ; also sheet 1
VBAT3 [morepower]: C45.+ L5.2 ; also sheet 1
VIN [morepower]: C30.1 C33.1 C36.1 C39.1 D1.C U$16.P$5A(VIN) U$16.P$5B(VIN1) U$16.P$5C(VIN2) U$16.P$5D(VIN3) U$16.P$5E(VIN4) U$16.P$5F(VIN5) U$17.P$5A(VIN) U$17.P$5B(VIN1) U$17.P$5C(VIN2) U$17.P$5D(VIN3) U$17.P$5E(VIN4) U$17.P$5F(VIN5) U$18.P$5A(VIN) U$18.P$5B(VIN1) U$18.P$5C(VIN2) U$18.P$5D(VIN3) U$18.P$5E(VIN4) U$18.P$5F(VIN5) U$19.P$5A(VIN) U$19.P$5B(VIN1) U$19.P$5C(VIN2) U$19.P$5D(VIN3) U$19.P$5E(VIN4) U$19.P$5F(VIN5)
VSW0 [morepower]: L2.1 TP8.TP U$16.P$4A(VSW) U$16.P$4B(VSW1) U$16.P$4C(VSW2) U$16.P$4D(VSW3) U$16.P$4E(VSW4) U$16.P$4F(VSW5)
VSW1 [morepower]: L3.1 TP5.TP U$17.P$4A(VSW) U$17.P$4B(VSW1) U$17.P$4C(VSW2) U$17.P$4D(VSW3) U$17.P$4E(VSW4) U$17.P$4F(VSW5)
VSW2 [morepower]: L4.1 TP10.TP U$18.P$4A(VSW) U$18.P$4B(VSW1) U$18.P$4C(VSW2) U$18.P$4D(VSW3) U$18.P$4E(VSW4) U$18.P$4F(VSW5)
VSW3 [morepower]: L5.1 TP15.TP U$19.P$4A(VSW) U$19.P$4B(VSW1) U$19.P$4C(VSW2) U$19.P$4D(VSW3) U$19.P$4E(VSW4) U$19.P$4F(VSW5)

### Notes on the sheet
- 5V total max current on this sheet 33mA
- LIPO chargers

## Library data of the parts
19V AN0 EMLE TP5 TP8 TP10 TP15 TPLED0 TPLED1-TPLED7 VBAT0 VBAT1-VBAT3 = testpad:TP: Test pad
C1-C3 C5 C8 C10 C15 C17 C19 C21 C22 C24 C26 C27 C29-C40 = rcl:C-EU: CAPACITOR, European symbol
C4 C6 C7 C9 C11-C14 C46-C49 = SparkFun:CAP: Capacitor Standard 0603 ceramic capacitor, and 0.1" leaded capacitor.
C16 C18 C41-C45 = rcl:CPOL-EU: POLARIZED CAPACITOR, European symbol
C20 C25 = smd-ipc:C0402
C23 C28 = resistor:C-EU: CAPACITOR, European symbol
CN2 = adafruit:USB: USB Connectors USBMINIB - Surface Mount Female Mini-B USB Connector 4UConnector: 06564 By microbuilder.eu Thru-hole RA Female Mini-B USB Connector 4UConnector: 18732 By ladyada.net
D1 = diode:MBRS3*0T3: SCHOTTKY BARRIER RECTIFIER 3.0 AMPERES 20, 30, 40 VOLT Source: MBRS340T3-D.pdf
D2 = diode:MBR0520LT: SCHOTTKY BARRIER RECTIFIER Source: http://onsemi.com .. MBR0520LT1-D.pdf
D7 = diode:BAT54: Schottky Diodes Source: Fairchild .. BAT54.pdf
D8 = SparkFun-LED:LED-RGB-CC-THRU: RGB Through-hole common cathode LED SparkFun Storefront: COM-00105 (Clear) COM-09264 (Diffuse); PROD_ID: DIO-09434
IC2 = samuel:TPS773*: 250-mA LDO REGULATORS WITH RESET OUTPUT WITH 8-PIN MSOP PACKAGING Source: http://focus.ti.com/lit/ds/symlink/tps77333.pdf
IC3 = burr-brown:REG1117: 800mA and 1A Low Dropout (LDO) Positive Regulator 1.8V, 2.5V, 2.85V, 3.3V, 5V, and Adj; MPN: REG1117; OC_FARNELL: 1097566; OC_NEWARK: 14P6981
JP2 = pinhead:PINHD-2X7: PIN HEADER
L1 = wuerth-elektronik:WE-KIHQ: SMD Wire Wound Ceramic Inductor WE-KIHQ - High current - Highest Quality factor in size 0805 - up to 98 - High thermal stability - High SRF -- Bluetooth -- Wireless LAN -- RF oscillation circuit -- IF impedance matching -- IG choke
L2-L5 = inductors:DR73: High Power Density, High Efficiency, Shielded Inductors Source: coiltronics_dr_series.pdf
LED0 LED1-LED7 = SparkFun:LED: LEDs Standard schematic elements and footprints for 5mm, 3mm, 1206, and 0603 sized LEDs. 5mm - Spark Fun Electronics SKU : COM-00529 (and others)
Q1 = crystal:CRYSTAL: CRYSTAL; OC_FARNELL: unknown; OC_NEWARK: unknown
R1-R19 R22-R36 = rcl:R-EU_: RESISTOR, European symbol
S1 S9 = SparkFun-Electromechanical:SWITCH-MOMENTARY-2: Various NO switches- pushbuttons, reed, etc
S2 S6-S8 = SparkFun-Electromechanical:TAC_SWITCH: Momentary Switch Button commonly used for reset or general input. Spark Fun Electronics SKU : COM-00097 SMT- SWCH-08247; PROD_ID: SWCH-08247
SG1 = SparkFun:BUZZER: Buzzer 12mm Spark Fun Electronics SKU : Comp-Buzzer
U1 U2 = SparkFun-Sensors:MPU-6000: MPU-6000 - I2C address is 0x68 with AD0 low and 0x69 with AD0 high.
U$1 = supercap-EDLRD224V3R6C:EDLRD224V3R6C
U$2 = SparkFun-Connectors:USB+SHIELD: USB+Shield USB connector with shield pins connectable
U$3 = oled:ER-OLEDM032-1
U$14 = renesas_rx:R5F5630ADDFP
U$16-U$19 = CSD97374Q4M:CSD97374Q4M
X1 = adafruit:XTAL: Low cost SMT crystals, no capacitors included http://www.ladyada.net/library/eagle
X2 = con-3m:2534-: 3M (TM) Pak 100 4-Wall Header Source: 3M; OC_FARNELL: unknown; OC_NEWARK: unknown
X3 = con-molex:22-23-2021: .100" (2.54mm) Center Header - 2 Pin; MF: MOLEX; MPN: 22-23-2021; OC_FARNELL: 1462926; OC_NEWARK: 25C3832

## Net classes
0 default: width 0.203 mm, drill 0.3 mm, clearance 0.203 mm
1 power: width 0.635 mm, drill 0.6 mm, clearance 0.178 mm
2 morepower: width 1.016 mm, drill 0.6 mm, clearance 0.178 mm
3 thin: width 0.152 mm, drill 0.3 mm, clearance 0.152 mm